# Altium schematic sheet U254-051T-4BH23-S2S_C4823611_U254-051T-4BH23-S2S_C482361.schdoc.schdoc
size 124 x 101 mm
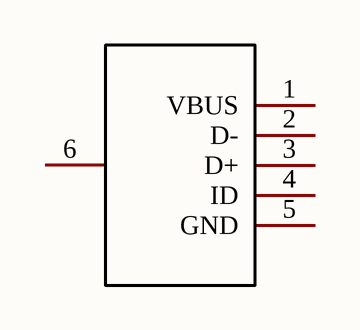
[diagram p0: U254-051T-4BH23-S2S_C4823611_U254-051T-4BH23-S2S_C482361.schdoc.schdoc]

## Parts
USB?  U254-051T-4BH23-S2S  [MICRO-USB-SMD_U254-051T-4BH23-S2S]  (value not drawn)

## Nets

Not connected (* = marked no-connect by the designer): USB? 1(VBUS) 2(D-) 3(D+) 4(ID) 5(GND) 6(EH)

## Library data of the parts
USB? = U254-051T-4BH23-S2S: Manufacturer: XKB Connectivity(中国星坤); Symbol: U254-051T-4BH23-S2S_C482361; Add into BOM: yes; Connector Type: Micro-B; Gender: 母; Number of Ports: 1; Number of Contacts: 5P; Current Rating - Power (Max): 1.8A; Soldering Temperature(Max): 260℃; Device: U254-051T-4BH23-S2S; Supplier: LCSC; Supplier Part: C482361; Manufacturer Part: U254-051T-4BH23-S2S; JLCPCB Part Class: Extended Part; LCSC Part Name: Micro-B 母 卧贴; Supplier Footprint: SMD; Datasheet: https://atta.szlcsc.com/upload/public/pdf/source/20211011/BAA279962023C91D65D7E291D0BA8E57.pdf; Convert to PCB: yes; Standard: USB 2.0; Mounting Style: 卧贴; Contact Material: 铜合金; Contact Plating: 金; Operating Temperature Range: -40℃~+85℃